# Altium schematic sheet przejsciowka.SchDoc
size A4
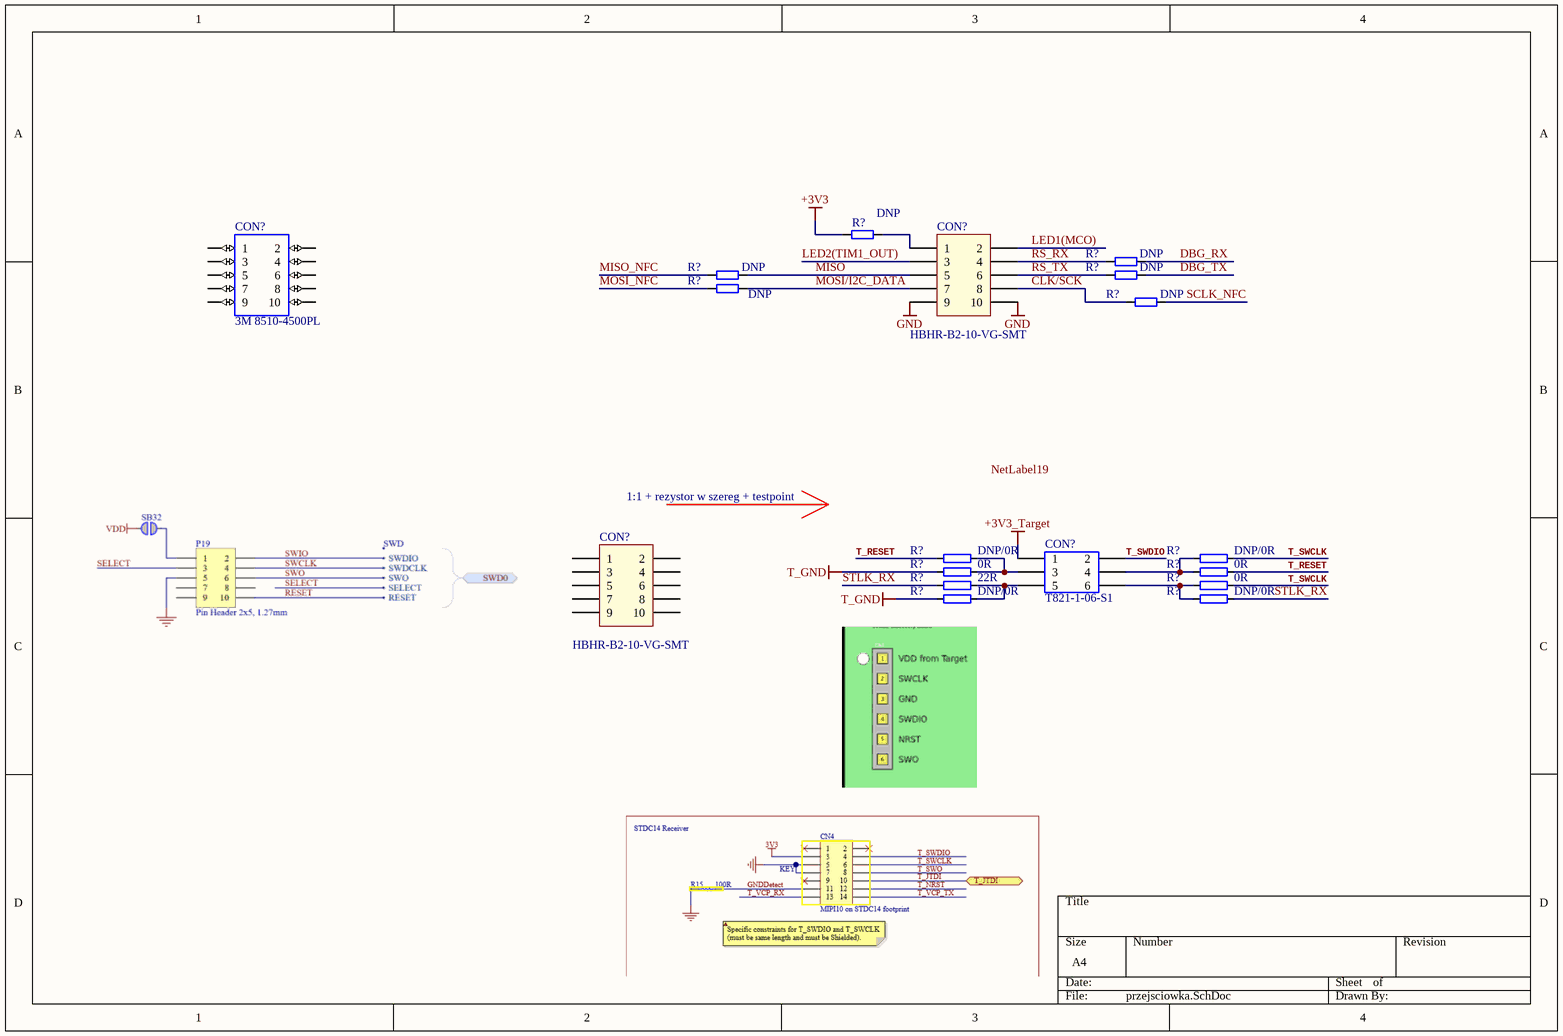
[diagram p0: przejsciowka.SchDoc]

## Parts
(Parts that share a designator on the sheet are numbered #1, #2 ... from top to bottom, then left to right.)
CON?#1  3M 8510-4500PL  [PINY2X5 zenskie]
CON?#2  HBHR-B2-10-VG-SMT  [piny_1k27_2x5_smd_IDC]
CON?#3  T821-1-06-S1  [IDC_2X3_2.54MM]
CON?#4  HBHR-B2-10-VG-SMT  [piny_1k27_2x5_smd_IDC]
R?#1  DNP  [0805]
R?#2  DNP  [0603]
R?#3  DNP  [0603]
R?#4  DNP  [0603]
R?#5  DNP  [0603]
R?#6  DNP  [0603]
R?#7  DNP/0R  [0603]
R?#8  DNP/0R  [0603]
R?#9  0R  [0603]
R?#10  0R  [0603]
R?#11  22R  [0603]
R?#12  0R  [0603]
R?#13  DNP/0R  [0603]
R?#14  DNP/0R  [0603]

## Nets
+3V3: R?#1.1
+3V3_Target: CON?#3.1
GND: CON?#2.9 CON?#2.10
T_GND: R?#9.2 R?#13.2
CLK/SCK: CON?#2.8 R?#6.1
DBG_RX: R?#2.2
DBG_TX: R?#4.2
LED1(MCO): CON?#2.2
LED2(TIM1_OUT): CON?#2.3
MISO: CON?#2.5 R?#3.2
MISO_NFC: R?#3.1
MOSI/I2C_DATA: CON?#2.7 R?#5.2
MOSI_NFC: R?#5.1
RS_RX: CON?#2.4 R?#2.1
RS_TX: CON?#2.6 R?#4.1
SCLK_NFC: R?#6.2
STLK_RX: R?#11.2 R?#14.1
T_RESET: R?#7.2 R?#10.1
T_SWCLK: R?#8.1 R?#12.1
T_SWDIO: CON?#3.2
NetCON?#2_1: CON?#2.1 R?#1.2
NetCON?#3_3: CON?#3.3 R?#7.1 R?#9.1
NetCON?#3_4: CON?#3.4 R?#8.2 R?#10.2
NetCON?#3_5: CON?#3.5 R?#11.1 R?#13.1
NetCON?#3_6: CON?#3.6 R?#12.2 R?#14.2

Not connected (* = marked no-connect by the designer): CON?#1 1 2 3 4 5 6 7 8 9 10; CON?#4 1 2 3 4 5 6 7 8 9 10

## Notes on the sheet
- 1:1 + rezystor w szereg + testpoint
- Labels drawn without touching a wire or pin: NetLabel19

## Library data of the parts
CON?#1 = piny_2x5 zenskie Petroster: Gniazdo; IDC; żeńskie; PIN: 10; proste; THT; złocony; 3A; 2,54mm
CON?#2 CON?#4 = AMC_Debug: AMC Debug connector / IDC 2x5 pitch 1.27
CON?#3 = piny_2x3: idc-pionowe: maritex: bh06s , tme: ZL231-6PG
R?#1-R?#6 = rez_3k: Value: =Comments
R?#7-R?#14 = RES
  R?#7 R?#8 R?#13 R?#14: Value: DNP/0R
  R?#9 R?#10 R?#12: Value: 0R
  R?#11: Value: 22R